# Altium schematic sheet imu.SchDoc
size A4
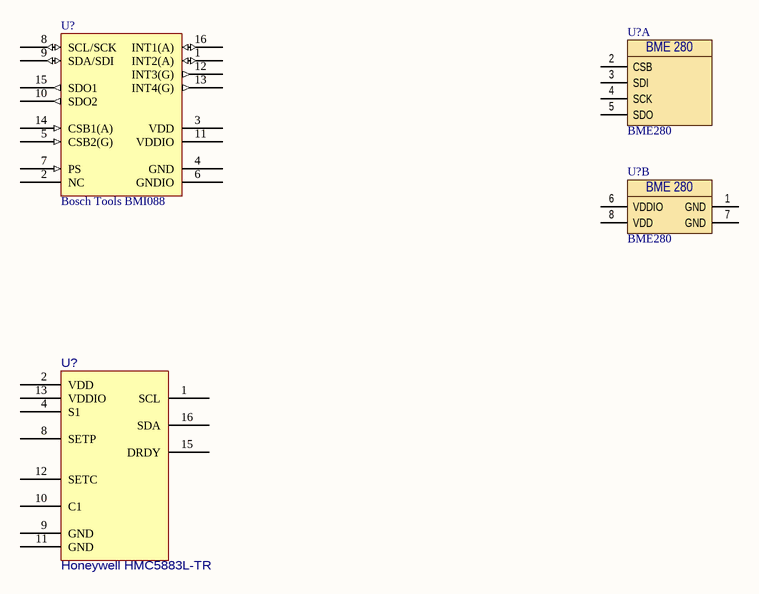
[diagram p0: imu.SchDoc]

## Parts
(Parts that share a designator on the sheet are numbered #1, #2 ... from top to bottom, then left to right.)
U?#1  Bosch Tools BMI088  [PCB-rx9ouf6ws7u2trts4ghn-1]
U?#2  BME280  [PCB-pz4u251hci7fplawf7tn-1]  (part A of 2)
U?#3  BME280  [PCB-pz4u251hci7fplawf7tn-1]  (part B of 2)
U?#4  Honeywell HMC5883L-TR  [PCB-2968744-2]

## Nets

Not connected (* = marked no-connect by the designer): U?#1 1(INT2(A)) 2(NC) 3(VDD) 4(GND) 5(CSB2(G)) 6(GNDIO) 7(PS) 8(SCL/SCK) 9(SDA/SDI) 10(SDO2) 11(VDDIO) 12(INT3(G)) 13(INT4(G)) 14(CSB1(A)) 15(SDO1) 16(INT1(A)); U?#2 2(CSB) 3(SDI) 4(SCK) 5(SDO); U?#3 1(GND) 6(VDDIO) 7(GND) 8(VDD); U?#4 1(SCL) 2(VDD) 4(S1) 8(SETP) 9(GND) 10(C1) 11(GND) 12(SETC) 13(VDDIO) 15(DRDY) 16(SDA)

## Notes on the sheet
- (in symbol CMP-19345792-15, part A) BME 280
- (in symbol CMP-19345792-15, part B) BME 280

## Library data of the parts
U?#1 = CMP-3c8ff0f6eb07e348-2: BMI088 Series 3.6 V 6 Axis Digital Output Accelerometer Motion Sensor - LGA-16; Lead-Free Status: Lead Free; Manufacturer Part Number: BMI088; Octopart URL: https://octopart.com/bmi088-bosch+tools-91484910; OctopartID: 3c8ff0f6eb07e348; RoHS: Compliant
U?#2 U?#3 = CMP-19345792-15: Pressure, Temperature and Humidity Sensor Digital Output 1.8V 8-Pin LGA T/R; Lead-Free Status: Lead Free; Octopart URL: https://octopart.com/bme280-bosch+tools-52931981
U?#4 = CMP-2968744-5: MAGNETIC SENSOR ON TAPE AND REEL; Manufacturer Part Number: HMC5883L-TR; Number of Pins: 16; OctopartID: b1a37a0cbc0b6e64; Octopart Url: http://octopart.com/hmc5883l-tr-honeywell-44378318; RoHS: Compliant